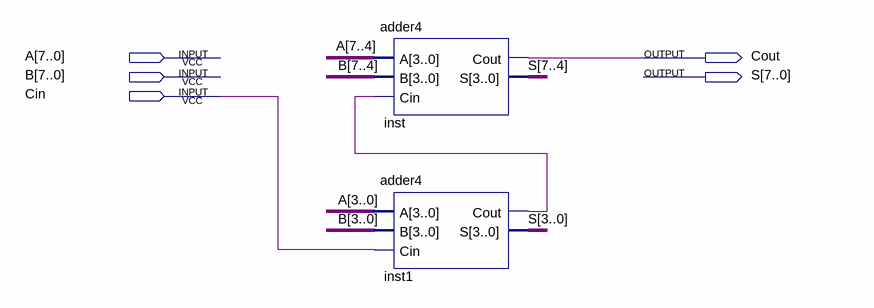
[diagram p0: schematic sheet]
// Quartus schematic adder8.bdf as structural Verilog: 2 symbols, 5 pins
module adder8 (
  input  [7:0] A,
  input  [7:0] B,
  input  Cin,
  output Cout,
  output [7:0] S
);

  wire inst1_cout;

  adder4 inst (.A(A[7:4]), .B(B[7:4]), .Cin(inst1_cout), .Cout(Cout), .S(S[7:4]));
  adder4 inst1 (.A(A[3:0]), .B(B[3:0]), .Cin(Cin), .Cout(inst1_cout), .S(S[3:0]));
endmodule
